# Altium schematic sheet TP_IHM_MAIN.SchDoc
size A4
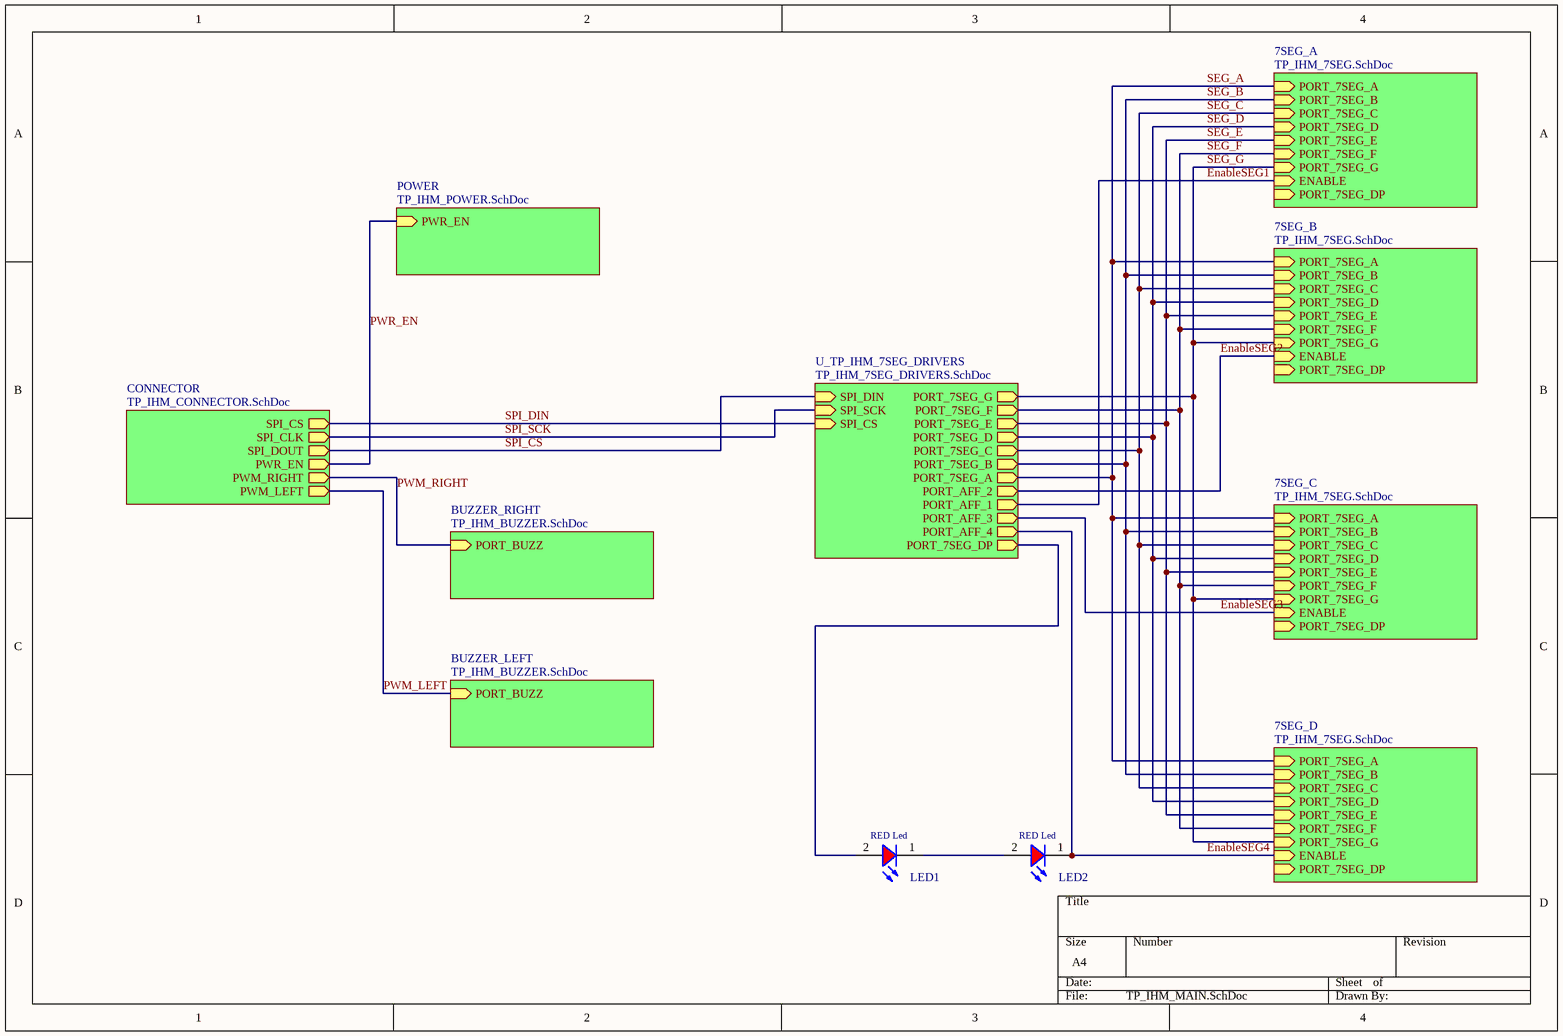
[diagram p0: TP_IHM_MAIN.SchDoc]

## Parts
LED1  RED Led  [LED_0603_RED]
LED2  RED Led  [LED_0603_RED]

## Sub-sheets
7SEG_A = TP_IHM_7SEG.SchDoc: PORT_7SEG_A (in), PORT_7SEG_B (in), PORT_7SEG_C (in), PORT_7SEG_D (in), PORT_7SEG_E (in), PORT_7SEG_F (in), PORT_7SEG_G (in), ENABLE (in), PORT_7SEG_DP (in)
7SEG_B = TP_IHM_7SEG.SchDoc: PORT_7SEG_A (in), PORT_7SEG_B (in), PORT_7SEG_C (in), PORT_7SEG_D (in), PORT_7SEG_E (in), PORT_7SEG_F (in), PORT_7SEG_G (in), ENABLE (in), PORT_7SEG_DP (in)
7SEG_C = TP_IHM_7SEG.SchDoc: PORT_7SEG_A (in), PORT_7SEG_B (in), PORT_7SEG_C (in), PORT_7SEG_D (in), PORT_7SEG_E (in), PORT_7SEG_F (in), PORT_7SEG_G (in), ENABLE (in), PORT_7SEG_DP (in)
7SEG_D = TP_IHM_7SEG.SchDoc: PORT_7SEG_A (in), PORT_7SEG_B (in), PORT_7SEG_C (in), PORT_7SEG_D (in), PORT_7SEG_E (in), PORT_7SEG_F (in), PORT_7SEG_G (in), ENABLE (in), PORT_7SEG_DP (in)
BUZZER_LEFT = TP_IHM_BUZZER.SchDoc: PORT_BUZZ (in)
BUZZER_RIGHT = TP_IHM_BUZZER.SchDoc: PORT_BUZZ (in)
CONNECTOR = TP_IHM_CONNECTOR.SchDoc: SPI_CS (out), SPI_CLK (out), SPI_DOUT (out), PWR_EN (out), PWM_RIGHT (out), PWM_LEFT (out)
POWER = TP_IHM_POWER.SchDoc: PWR_EN (in)
U_TP_IHM_7SEG_DRIVERS = TP_IHM_7SEG_DRIVERS.SchDoc: PORT_7SEG_G (out), PORT_7SEG_F (out), PORT_7SEG_E (out), PORT_7SEG_D (out), PORT_7SEG_C (out), PORT_7SEG_B (out), PORT_7SEG_A (out), PORT_AFF_2 (out), PORT_AFF_1 (out), PORT_AFF_3 (out), PORT_AFF_4 (out), SPI_DIN (in), SPI_SCK (in), SPI_CS (in), PORT_7SEG_DP (out)

## Nets
EnableSEG1: sheet U_TP_IHM_7SEG_DRIVERS/PORT_AFF_1, sheet 7SEG_A/ENABLE
EnableSEG2: sheet U_TP_IHM_7SEG_DRIVERS/PORT_AFF_2, sheet 7SEG_B/ENABLE
EnableSEG3: sheet U_TP_IHM_7SEG_DRIVERS/PORT_AFF_3, sheet 7SEG_C/ENABLE
EnableSEG4: LED2.1(K) ; sheet U_TP_IHM_7SEG_DRIVERS/PORT_AFF_4, sheet 7SEG_D/ENABLE
PWM_LEFT: sheet CONNECTOR/PWM_LEFT, sheet BUZZER_LEFT/PORT_BUZZ
PWM_RIGHT: sheet BUZZER_RIGHT/PORT_BUZZ, sheet CONNECTOR/PWM_RIGHT
PWR_EN: sheet CONNECTOR/PWR_EN, sheet POWER/PWR_EN
SEG_A: sheet U_TP_IHM_7SEG_DRIVERS/PORT_7SEG_A, sheet 7SEG_A/PORT_7SEG_A, sheet 7SEG_B/PORT_7SEG_A, sheet 7SEG_C/PORT_7SEG_A, sheet 7SEG_D/PORT_7SEG_A
SEG_B: sheet U_TP_IHM_7SEG_DRIVERS/PORT_7SEG_B, sheet 7SEG_A/PORT_7SEG_B, sheet 7SEG_B/PORT_7SEG_B, sheet 7SEG_C/PORT_7SEG_B, sheet 7SEG_D/PORT_7SEG_B
SEG_C: sheet U_TP_IHM_7SEG_DRIVERS/PORT_7SEG_C, sheet 7SEG_A/PORT_7SEG_C, sheet 7SEG_B/PORT_7SEG_C, sheet 7SEG_C/PORT_7SEG_C, sheet 7SEG_D/PORT_7SEG_C
SEG_D: sheet U_TP_IHM_7SEG_DRIVERS/PORT_7SEG_D, sheet 7SEG_A/PORT_7SEG_D, sheet 7SEG_B/PORT_7SEG_D, sheet 7SEG_C/PORT_7SEG_D, sheet 7SEG_D/PORT_7SEG_D
SEG_E: sheet U_TP_IHM_7SEG_DRIVERS/PORT_7SEG_E, sheet 7SEG_A/PORT_7SEG_E, sheet 7SEG_B/PORT_7SEG_E, sheet 7SEG_C/PORT_7SEG_E, sheet 7SEG_D/PORT_7SEG_E
SEG_F: sheet U_TP_IHM_7SEG_DRIVERS/PORT_7SEG_F, sheet 7SEG_A/PORT_7SEG_F, sheet 7SEG_B/PORT_7SEG_F, sheet 7SEG_C/PORT_7SEG_F, sheet 7SEG_D/PORT_7SEG_F
SEG_G: sheet U_TP_IHM_7SEG_DRIVERS/PORT_7SEG_G, sheet 7SEG_A/PORT_7SEG_G, sheet 7SEG_B/PORT_7SEG_G, sheet 7SEG_C/PORT_7SEG_G, sheet 7SEG_D/PORT_7SEG_G
SPI_CS: sheet CONNECTOR/SPI_DOUT, sheet U_TP_IHM_7SEG_DRIVERS/SPI_DIN
SPI_DIN: sheet CONNECTOR/SPI_CS, sheet U_TP_IHM_7SEG_DRIVERS/SPI_CS
SPI_SCK: sheet CONNECTOR/SPI_CLK, sheet U_TP_IHM_7SEG_DRIVERS/SPI_SCK
NetLED1_1: LED1.1(K) LED2.2(A)
NetLED1_2: LED1.2(A) ; sheet U_TP_IHM_7SEG_DRIVERS/PORT_7SEG_DP

## Library data of the parts
LED1 LED2 = LED_RED_SMD_WE_150060RS750x0: LED RED SMD WE 150060RS750x0; ref: 150060RS750x0